# Altium project ESF Schematics TS_23.PrjPcb
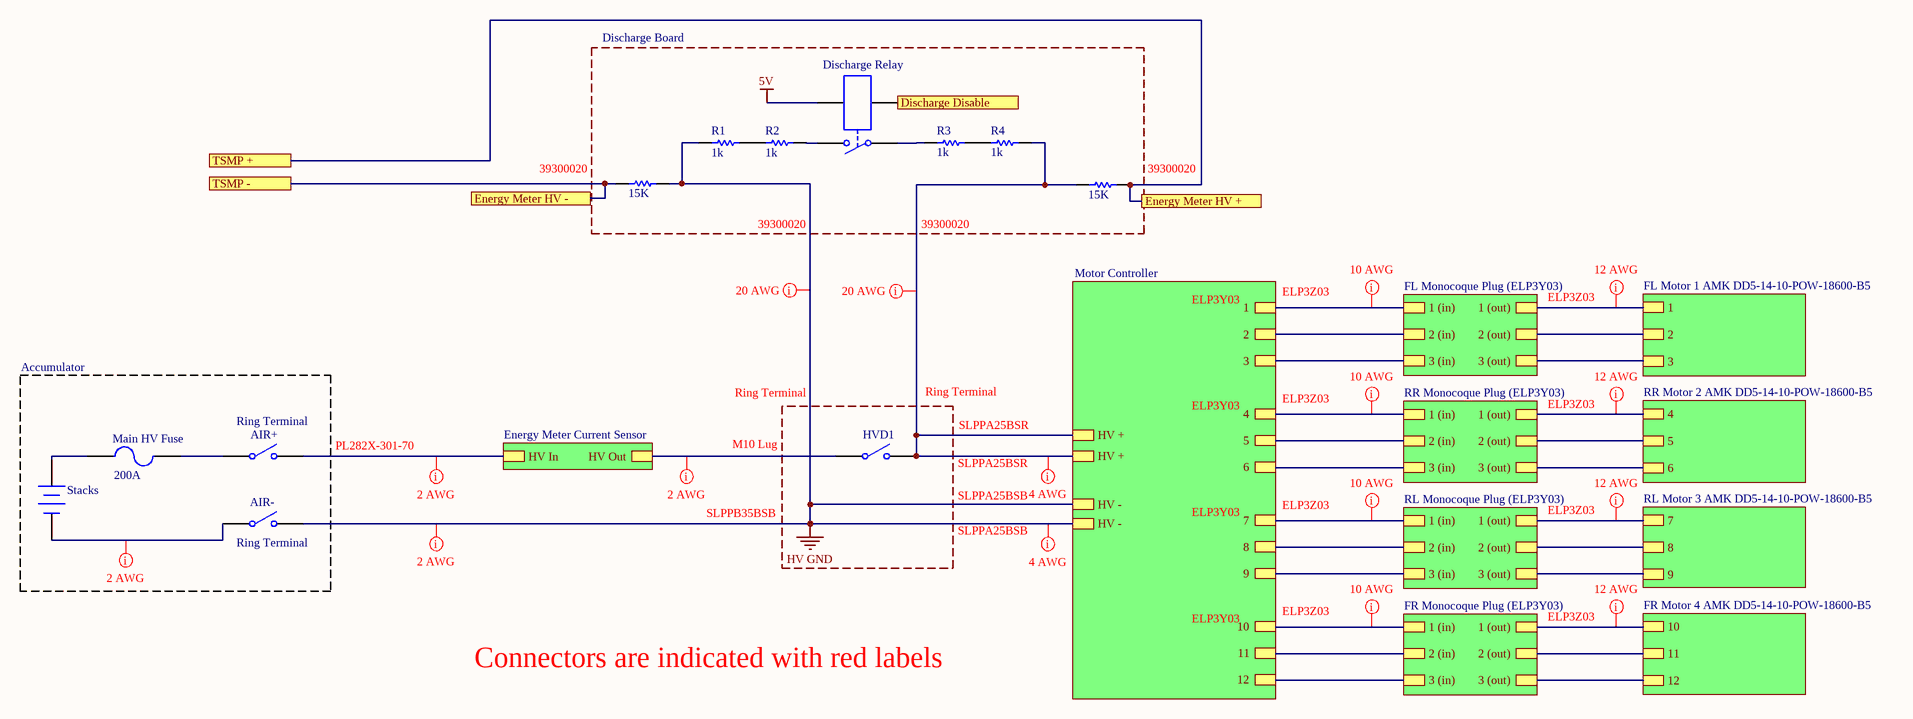
[diagram p0: Tractive System Schematic.SchDoc]
2 sheets, 32 parts. Net scope: hierarchical (ports join the sheet entries above them; power ports are global).
Sheets:
  Tractive System Schematic.SchDoc
  Accumulator TS Circuits.SchDoc

## Sheet Tractive System Schematic.SchDoc
size A3; SheetNumber: 1; SheetTotal: 2

### Parts
AIR+  (no value)  [SPST-2]
AIR-  (no value)  [SPST-2]
Discharge_Relay  (no value)  [MODULE4]
HVD1  (no value)  [SPST-2]
Main_HV_Fuse  200A  [PIN-W2/E2.8]
R1  1k  [B TO-263]
R2  1k  [B TO-263]
R3  1k  [B TO-263]
R4  1k  [B TO-263]
R5  15K  [0805]
R6  15K  [0805]
Stacks  (no value)  [BAT-2]

### Blocks framed on the sheet
Ring Terminal: HVD1

### Sub-sheets
Energy Meter Current Sensor = File Name (file not in this document): HV Out, HV In
FL Monocoque Plug (ELP3Y03) = File Name (file not in this document): 1 (in), 2 (in), 3 (in), 3 (out), 2 (out), 1 (out)
FL Motor 1 AMK DD5-14-10-POW-18600-B5 = File Name (file not in this document): 2, 3, 1
FR Monocoque Plug (ELP3Y03) = File Name (file not in this document): 1 (in), 2 (in), 3 (in), 3 (out), 2 (out), 1 (out)
FR Motor 4 AMK DD5-14-10-POW-18600-B5 = File Name (file not in this document): 10, 11, 12
Motor Controller = File Name (file not in this document): HV +, HV -, 1, 2, 3, 4, 5, 6, 7, 8, 9, 10, 11, 12, HV +, HV -
RL Monocoque Plug (ELP3Y03) = File Name (file not in this document): 1 (in), 2 (in), 3 (in), 3 (out), 2 (out), 1 (out)
RL Motor 3 AMK DD5-14-10-POW-18600-B5 = File Name (file not in this document): 7, 8, 9
RR Monocoque Plug (ELP3Y03) = File Name (file not in this document): 1 (in), 2 (in), 3 (in), 3 (out), 2 (out), 1 (out)
RR Motor 2 AMK DD5-14-10-POW-18600-B5 = File Name (file not in this document): 4, 5, 6

### Ports
Discharge Disable, Energy Meter HV +, Energy Meter HV -, TSMP +, TSMP -

### Nets
5V: Discharge_Relay.4
HV GND: AIR-.2(NO) R1.1 R5.2 ; sheet Motor Controller/HV -, sheet Motor Controller/HV -
NetAIR+_1: AIR+.1(COMMON) Main_HV_Fuse.2
NetAIR+_2: AIR+.2(NO) ; sheet Energy Meter Current Sensor/HV In
NetAIR-_1: AIR-.1(COMMON) Stacks.2(-)
NetDischarge_Relay_1: Discharge_Relay.1 R3.1
NetDischarge_Relay_2: Discharge_Relay.2 R2.2
NetDischarge_Relay_3: Discharge_Relay.3 ; port Discharge Disable
NetHVD1_1: HVD1.1(COMMON) ; sheet Energy Meter Current Sensor/HV Out
NetHVD1_2: HVD1.2(NO) R4.2 R6.1 ; sheet Motor Controller/HV +, sheet Motor Controller/HV +
NetMain_HV_Fuse_1: Main_HV_Fuse.1 Stacks.1(+)
NetR1_2: R1.2 R2.1
NetR3_2: R3.2 R4.1
NetR5_1: R5.1 ; port TSMP -, port Energy Meter HV -
NetR6_2: R6.2 ; port TSMP +, port Energy Meter HV +
(unnamed): sheet Motor Controller/1, sheet FL Monocoque Plug (ELP3Y03)/1 (in)
(unnamed): sheet Motor Controller/2, sheet FL Monocoque Plug (ELP3Y03)/2 (in)
(unnamed): sheet Motor Controller/3, sheet FL Monocoque Plug (ELP3Y03)/3 (in)
(unnamed): sheet Motor Controller/4, sheet RR Monocoque Plug (ELP3Y03)/1 (in)
(unnamed): sheet Motor Controller/5, sheet RR Monocoque Plug (ELP3Y03)/2 (in)
(unnamed): sheet Motor Controller/6, sheet RR Monocoque Plug (ELP3Y03)/3 (in)
(unnamed): sheet Motor Controller/7, sheet RL Monocoque Plug (ELP3Y03)/1 (in)
(unnamed): sheet Motor Controller/8, sheet RL Monocoque Plug (ELP3Y03)/2 (in)
(unnamed): sheet Motor Controller/9, sheet RL Monocoque Plug (ELP3Y03)/3 (in)
(unnamed): sheet Motor Controller/10, sheet FR Monocoque Plug (ELP3Y03)/1 (in)
(unnamed): sheet Motor Controller/11, sheet FR Monocoque Plug (ELP3Y03)/2 (in)
(unnamed): sheet Motor Controller/12, sheet FR Monocoque Plug (ELP3Y03)/3 (in)
(unnamed): sheet FL Motor 1 AMK DD5-14-10-POW-18600-B5/2, sheet FL Monocoque Plug (ELP3Y03)/2 (out)
(unnamed): sheet FL Motor 1 AMK DD5-14-10-POW-18600-B5/3, sheet FL Monocoque Plug (ELP3Y03)/3 (out)
(unnamed): sheet FL Motor 1 AMK DD5-14-10-POW-18600-B5/1, sheet FL Monocoque Plug (ELP3Y03)/1 (out)
(unnamed): sheet RR Motor 2 AMK DD5-14-10-POW-18600-B5/4, sheet RR Monocoque Plug (ELP3Y03)/1 (out)
(unnamed): sheet RR Motor 2 AMK DD5-14-10-POW-18600-B5/5, sheet RR Monocoque Plug (ELP3Y03)/2 (out)
(unnamed): sheet RR Motor 2 AMK DD5-14-10-POW-18600-B5/6, sheet RR Monocoque Plug (ELP3Y03)/3 (out)
(unnamed): sheet RL Motor 3 AMK DD5-14-10-POW-18600-B5/7, sheet RL Monocoque Plug (ELP3Y03)/1 (out)
(unnamed): sheet RL Motor 3 AMK DD5-14-10-POW-18600-B5/8, sheet RL Monocoque Plug (ELP3Y03)/2 (out)
(unnamed): sheet RL Motor 3 AMK DD5-14-10-POW-18600-B5/9, sheet RL Monocoque Plug (ELP3Y03)/3 (out)
(unnamed): sheet FR Motor 4 AMK DD5-14-10-POW-18600-B5/10, sheet FR Monocoque Plug (ELP3Y03)/1 (out)
(unnamed): sheet FR Motor 4 AMK DD5-14-10-POW-18600-B5/11, sheet FR Monocoque Plug (ELP3Y03)/2 (out)
(unnamed): sheet FR Motor 4 AMK DD5-14-10-POW-18600-B5/12, sheet FR Monocoque Plug (ELP3Y03)/3 (out)

### Layout directives
mark named 2 AWG: HV GND, NetAIR+_2, NetAIR-_1, NetHVD1_1
mark named 20 AWG: HV GND, NetHVD1_2
mark named 10 AWG: (no net found under the mark)
mark named 4 AWG: HV GND, NetHVD1_2
mark named 12 AWG: (no net found under the mark)

### Notes on the sheet
- Discharge Board
- (near Discharge_Relay) Discharge Relay
- (near R5) 39300020
- (near R6) 39300020
- 39300020
- ELP3Y03
- ELP3Z03
- Accumulator
- (near AIR+) Ring Terminal
- Ring Terminal
- SLPPA25BSR
- PL282X-301-70
- M10 Lug
- SLPPA25BSB
- (near AIR-) Ring Terminal
- SLPPB35BSB
- Connectors are indicated with red labels

### Library data of the parts
AIR+ AIR- HVD1 = SW-SPST: Single-Pole, Single-Throw Switch; Published: 24-Mar-1999; LatestRevisionDate: 17-Jul-2002; LatestRevisionNote: Re-released for DXP Platform.; PackageReference: SPST-2; Publisher: Altium Limited; PackageDescription: Switch; 2 Leads
Discharge_Relay = Relay-SPST: Single-Pole Single-Throw Relay; Published: 24-Mar-1999; LatestRevisionDate: 17-Jul-2002; LatestRevisionNote: Re-released for DXP Platform.; PackageReference: MODULE4; Publisher: Altium Limited
Main_HV_Fuse = Fuse 2: Fuse; Published: 8-Jun-2000; LatestRevisionDate: 17-Jul-2002; LatestRevisionNote: Re-released for DXP Platform.; PackageReference: PIN-W2/E2.8; Publisher: Altium Limited; PackageDescription: Thru-Hole; 2 Leads
R1-R4 = PWR263S-35-1001J: Manufacturer: Bournes Inc; Tolerance: 0.05; Rated Voltage: 35W; Part Number: PWR263S-35-1001J; Value: 1k; Digikey Part Number: PWR263S-35-1001J-ND
R5 R6 = CMP-037-000330-3: RC0805FR0715KL; Rated Voltage: 0.125W; Tolerance: 0.01; Value: 15k; Digikey Part Number: 311-15.0KCRCT-ND; Material: FR-07
Stacks = Battery: Multicell Battery; Published: 24-Mar-1999; LatestRevisionDate: 17-Jul-2002; LatestRevisionNote: Re-released for DXP Platform.; PackageReference: BAT-2; Publisher: Altium Limited; PackageDescription: Battery; 2 Leads

## Sheet Accumulator TS Circuits.SchDoc
size A3; SheetNumber: 2; SheetTotal: 2
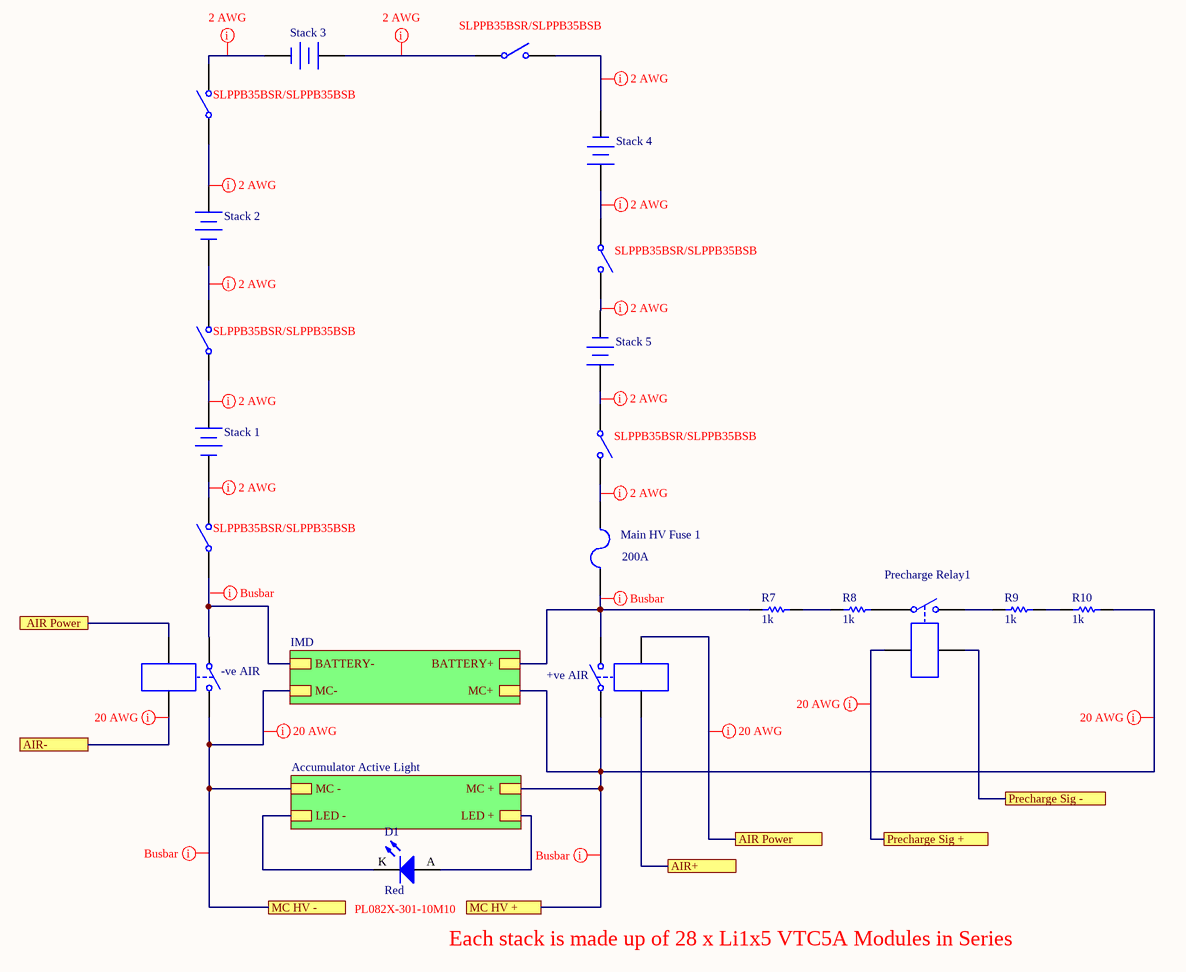
[diagram p1: Accumulator TS Circuits.SchDoc]

### Parts
(Parts that share a designator on the sheet are numbered #1, #2 ... from top to bottom, then left to right.)
+ve_AIR  (no value)  [MODULE4]
-ve_AIR  (no value)  [MODULE4]
D1  Red  [0805 LED]
Main_HV_Fuse_1  200A  [PIN-W2/E2.8]
Precharge_Relay1  (no value)  [MODULE4]
R7  value 1k  [AXIAL-0.3]
R8  value 1k  [AXIAL-0.3]
R9  value 1k  [AXIAL-0.3]
R10  value 1k  [AXIAL-0.3]
SLPPB35BSR/SLPPB35BSB#1  (no value)  [SPST-2]
SLPPB35BSR/SLPPB35BSB#2  (no value)  [SPST-2]
SLPPB35BSR/SLPPB35BSB#3  (no value)  [SPST-2]
SLPPB35BSR/SLPPB35BSB#4  (no value)  [SPST-2]
SLPPB35BSR/SLPPB35BSB#5  (no value)  [SPST-2]
SLPPB35BSR/SLPPB35BSB#6  (no value)  [SPST-2]
Stack_1  (no value)  [BAT-2]
Stack_2  (no value)  [BAT-2]
Stack_3  (no value)  [BAT-2]
Stack_4  (no value)  [BAT-2]
Stack_5  (no value)  [BAT-2]

### Sub-sheets
Accumulator Active Light = File Name (file not in this document): MC +, LED +, MC -, LED -
IMD = File Name (file not in this document): BATTERY+, MC+, BATTERY-, MC-

### Ports
AIR Power, AIR+, AIR-, MC HV +, MC HV -, Precharge Sig +, Precharge Sig -

### Nets
Net+ve_AIR_1: +ve_AIR.1 R10.2 ; port MC HV +, sheet IMD/MC+, sheet Accumulator Active Light/MC +
Net+ve_AIR_2: +ve_AIR.2 Main_HV_Fuse_1.2 R7.1 ; sheet IMD/BATTERY+
Net+ve_AIR_3: +ve_AIR.3 ; port AIR+
Net+ve_AIR_4: +ve_AIR.4 -ve_AIR.3 ; port AIR Power
Net-ve_AIR_1: -ve_AIR.1 SLPPB35BSR/SLPPB35BSB#6.1(COMMON) ; sheet IMD/BATTERY-
Net-ve_AIR_2: -ve_AIR.2 ; port MC HV -, sheet IMD/MC-, sheet Accumulator Active Light/MC -
Net-ve_AIR_4: -ve_AIR.4 ; port AIR-
NetD1_A: D1.A ; sheet Accumulator Active Light/LED +
NetD1_K: D1.K ; sheet Accumulator Active Light/LED -
NetMain_HV_Fuse_1_1: Main_HV_Fuse_1.1 SLPPB35BSR/SLPPB35BSB#5.2(NO)
NetPrecharge_Relay1_1: Precharge_Relay1.1 R8.2
NetPrecharge_Relay1_2: Precharge_Relay1.2 R9.1
NetPrecharge_Relay1_3: Precharge_Relay1.3 ; port Precharge Sig +
NetPrecharge_Relay1_4: Precharge_Relay1.4 ; port Precharge Sig -
NetR7_2: R7.2 R8.1
NetR9_2: R9.2 R10.1
NetSLPPB35BSR/SLPPB35BSB#1_1: SLPPB35BSR/SLPPB35BSB#1.1(COMMON) Stack_3.1(+)
NetSLPPB35BSR/SLPPB35BSB#1_2: SLPPB35BSR/SLPPB35BSB#1.2(NO) Stack_4.2(-)
NetSLPPB35BSR/SLPPB35BSB#2_1: SLPPB35BSR/SLPPB35BSB#2.1(COMMON) Stack_2.1(+)
NetSLPPB35BSR/SLPPB35BSB#2_2: SLPPB35BSR/SLPPB35BSB#2.2(NO) Stack_3.2(-)
NetSLPPB35BSR/SLPPB35BSB#3_1: SLPPB35BSR/SLPPB35BSB#3.1(COMMON) Stack_4.1(+)
NetSLPPB35BSR/SLPPB35BSB#3_2: SLPPB35BSR/SLPPB35BSB#3.2(NO) Stack_5.2(-)
NetSLPPB35BSR/SLPPB35BSB#4_1: SLPPB35BSR/SLPPB35BSB#4.1(COMMON) Stack_1.1(+)
NetSLPPB35BSR/SLPPB35BSB#4_2: SLPPB35BSR/SLPPB35BSB#4.2(NO) Stack_2.2(-)
NetSLPPB35BSR/SLPPB35BSB#5_1: SLPPB35BSR/SLPPB35BSB#5.1(COMMON) Stack_5.1(+)
NetSLPPB35BSR/SLPPB35BSB#6_2: SLPPB35BSR/SLPPB35BSB#6.2(NO) Stack_1.2(-)

### Layout directives
mark named 2 AWG: NetMain_HV_Fuse_1_1, NetSLPPB35BSR/SLPPB35BSB#1_1, NetSLPPB35BSR/SLPPB35BSB#1_2, NetSLPPB35BSR/SLPPB35BSB#2_1, NetSLPPB35BSR/SLPPB35BSB#2_2, NetSLPPB35BSR/SLPPB35BSB#3_1, NetSLPPB35BSR/SLPPB35BSB#3_2, NetSLPPB35BSR/SLPPB35BSB#4_1, NetSLPPB35BSR/SLPPB35BSB#4_2, NetSLPPB35BSR/SLPPB35BSB#5_1, NetSLPPB35BSR/SLPPB35BSB#6_2
mark named Busbar: (no net found under the mark), Net+ve_AIR_1, Net+ve_AIR_2, Net-ve_AIR_2
mark named 20 AWG: Net+ve_AIR_1, Net+ve_AIR_4, Net-ve_AIR_2, Net-ve_AIR_4, NetPrecharge_Relay1_3

### Notes on the sheet
- (near D1) PL082X-301-10M10
- Each stack is made up of 28 x Li1x5 VTC5A Modules in Series

### Library data of the parts
+ve_AIR -ve_AIR Precharge_Relay1 = Relay-SPST: Single-Pole Single-Throw Relay; Published: 24-Mar-1999; LatestRevisionDate: 17-Jul-2002; LatestRevisionNote: Re-released for DXP Platform.; PackageReference: MODULE4; Publisher: Altium Limited
D1 = SML-210LTT86: Red LED Indication - Discrete 1.75V 0805 (2012 Metric); Manufacturer: ROHM Semiconductor; Part Number: SML-210LTT86; Colour: Red; Digikey Part Number: 511-1286-1-ND
Main_HV_Fuse_1 = Fuse 2: Fuse; Published: 8-Jun-2000; LatestRevisionDate: 17-Jul-2002; LatestRevisionNote: Re-released for DXP Platform.; PackageReference: PIN-W2/E2.8; Publisher: Altium Limited; PackageDescription: Thru-Hole; 2 Leads
R7-R10 = Res1: Resistor; Published: 8-Jun-2000; LatestRevisionDate: 17-Jul-2002; LatestRevisionNote: Re-released for DXP Platform.; PackageReference: AXIAL-0.3; Publisher: Altium Limited; PackageDescription: Axial Device, Thru-Hole; 2 Leads; 0.3 in Pin Spacing
SLPPB35BSR/SLPPB35BSB#1-SLPPB35BSR/SLPPB35BSB#6 = SW-SPST: Single-Pole, Single-Throw Switch; Published: 24-Mar-1999; LatestRevisionDate: 17-Jul-2002; LatestRevisionNote: Re-released for DXP Platform.; PackageReference: SPST-2; Publisher: Altium Limited; PackageDescription: Switch; 2 Leads
Stack_1-Stack_5 = Battery: Multicell Battery; Published: 24-Mar-1999; LatestRevisionDate: 17-Jul-2002; LatestRevisionNote: Re-released for DXP Platform.; PackageReference: BAT-2; Publisher: Altium Limited; PackageDescription: Battery; 2 Leads